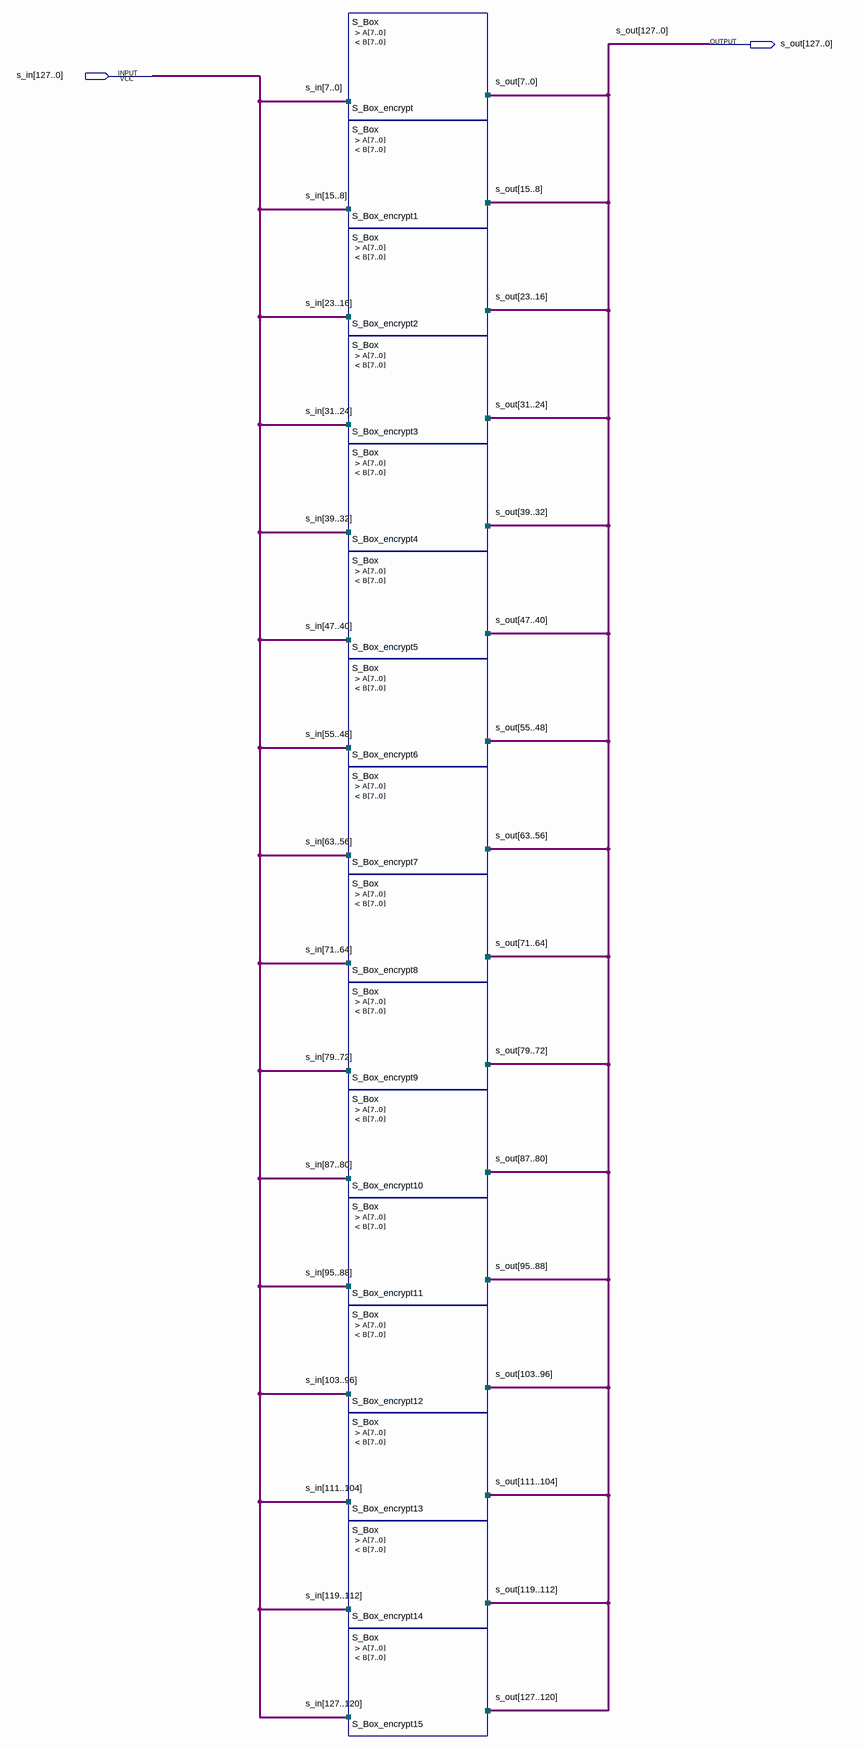
[diagram p0: schematic sheet]
// Quartus schematic S_box_enc_128b.bdf as structural Verilog: 16 symbols, 2 pins
module S_box_enc_128b (
  input  [127:0] s_in,
  output [127:0] s_out
);

  S_Box S_Box_encrypt (.A(s_in[7:0]), .B(s_out[7:0]));
  S_Box S_Box_encrypt1 (.A(s_in[15:8]), .B(s_out[15:8]));
  S_Box S_Box_encrypt2 (.A(s_in[23:16]), .B(s_out[23:16]));
  S_Box S_Box_encrypt3 (.A(s_in[31:24]), .B(s_out[31:24]));
  S_Box S_Box_encrypt4 (.A(s_in[39:32]), .B(s_out[39:32]));
  S_Box S_Box_encrypt5 (.A(s_in[47:40]), .B(s_out[47:40]));
  S_Box S_Box_encrypt6 (.A(s_in[55:48]), .B(s_out[55:48]));
  S_Box S_Box_encrypt7 (.A(s_in[63:56]), .B(s_out[63:56]));
  S_Box S_Box_encrypt8 (.A(s_in[71:64]), .B(s_out[71:64]));
  S_Box S_Box_encrypt9 (.A(s_in[79:72]), .B(s_out[79:72]));
  S_Box S_Box_encrypt10 (.A(s_in[87:80]), .B(s_out[87:80]));
  S_Box S_Box_encrypt11 (.A(s_in[95:88]), .B(s_out[95:88]));
  S_Box S_Box_encrypt12 (.A(s_in[103:96]), .B(s_out[103:96]));
  S_Box S_Box_encrypt13 (.A(s_in[111:104]), .B(s_out[111:104]));
  S_Box S_Box_encrypt14 (.A(s_in[119:112]), .B(s_out[119:112]));
  S_Box S_Box_encrypt15 (.A(s_in[127:120]), .B(s_out[127:120]));
endmodule
